# Altium schematic sheet PULSECAPS.SchDoc
size B
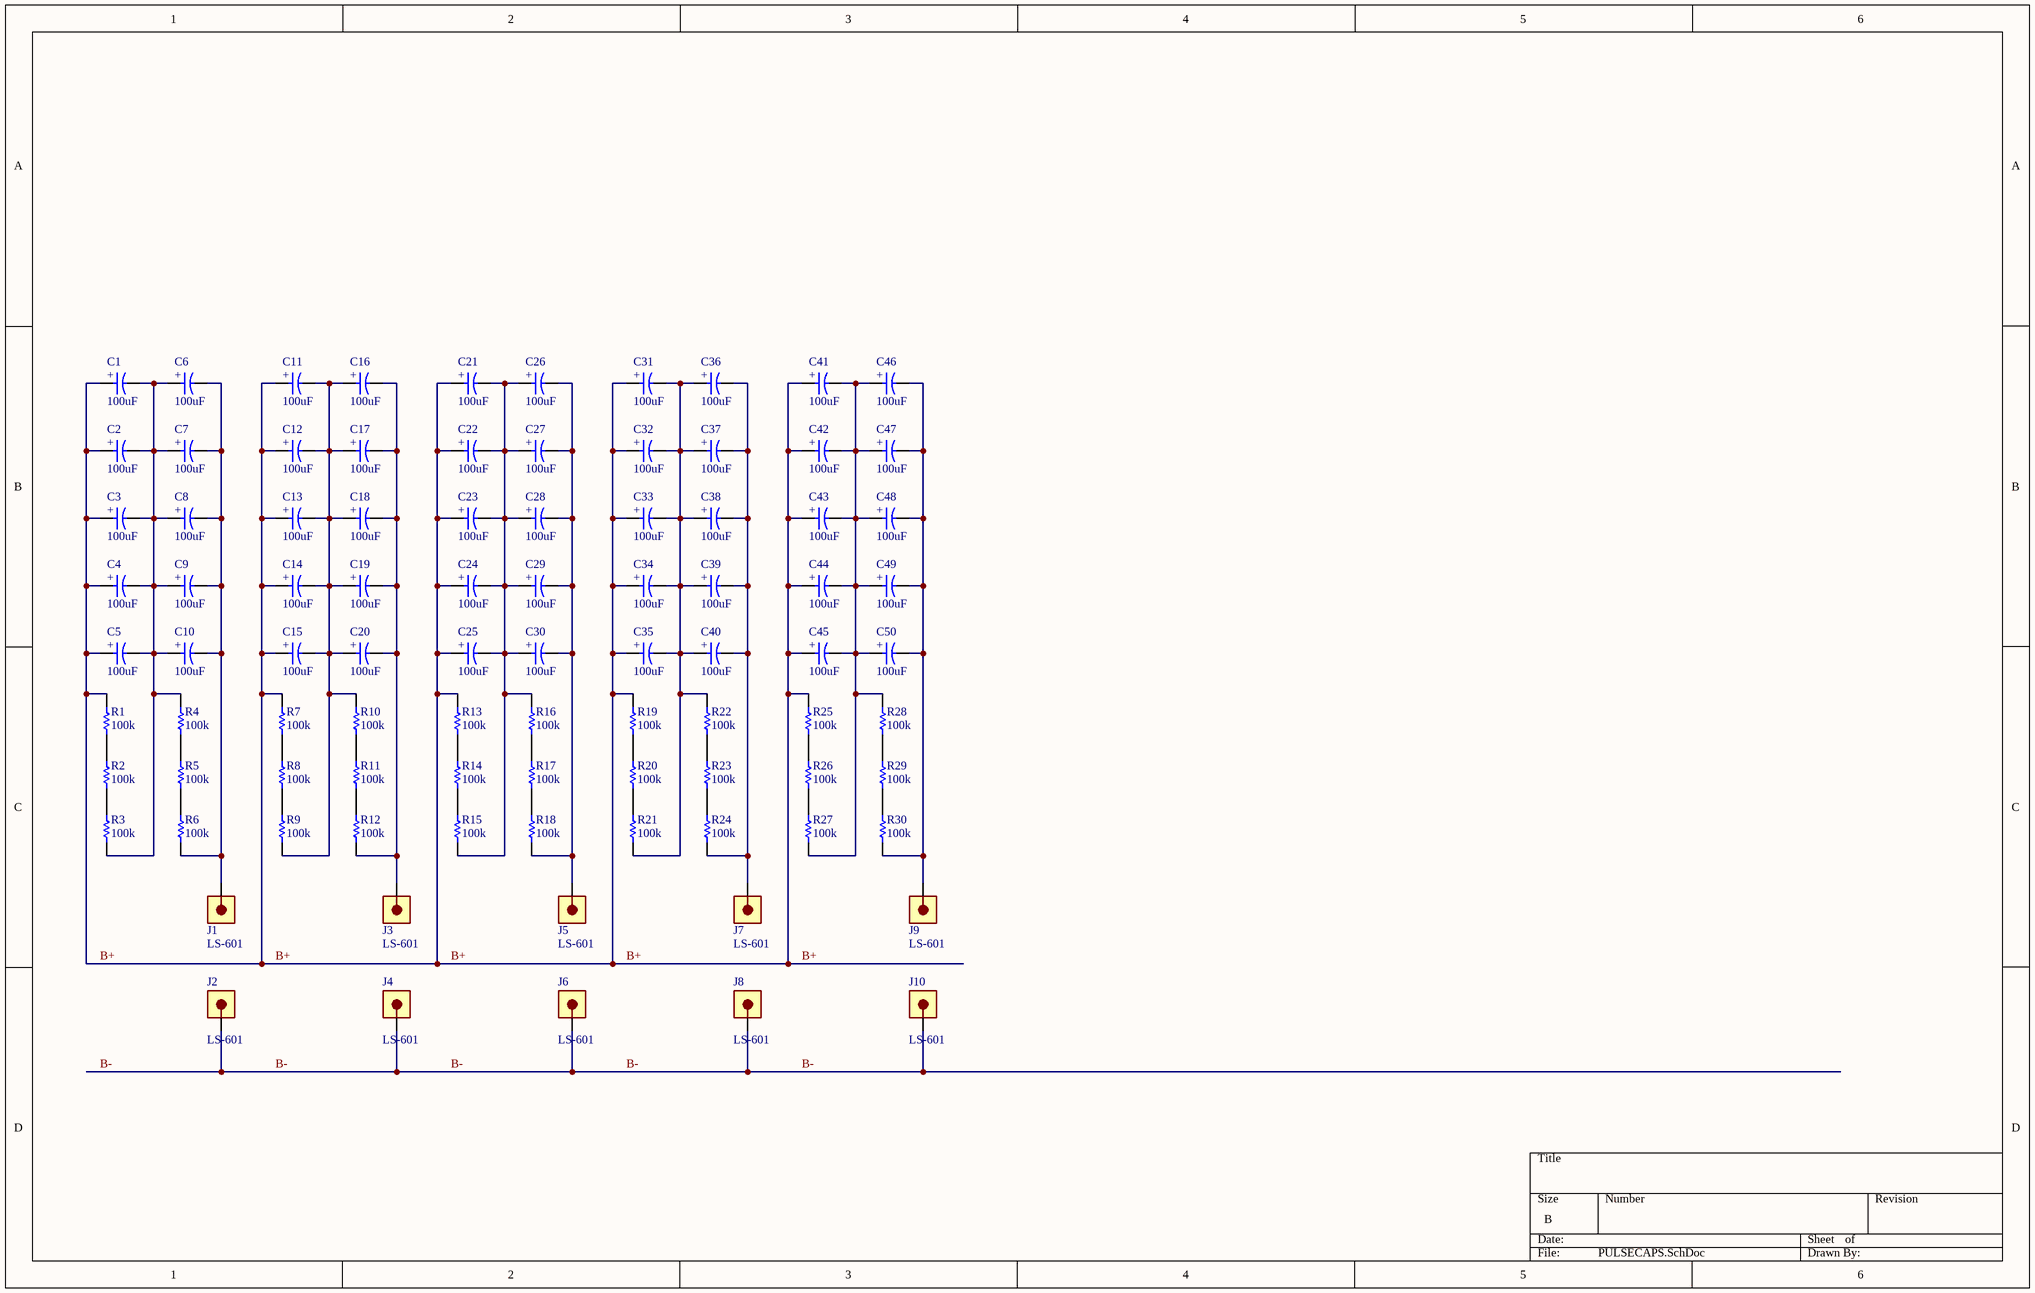
[diagram p0: PULSECAPS.SchDoc]

## Parts
C1  value 100uF  [C_CAN_TH_7.5MM_LEADS]  (hidden comment: 400BXW100MEFR16X30)
C2  value 100uF  [C_CAN_TH_7.5MM_LEADS]  (hidden comment: 400BXW100MEFR16X30)
C3  value 100uF  [C_CAN_TH_7.5MM_LEADS]  (hidden comment: 400BXW100MEFR16X30)
C4  value 100uF  [C_CAN_TH_7.5MM_LEADS]  (hidden comment: 400BXW100MEFR16X30)
C5  value 100uF  [C_CAN_TH_7.5MM_LEADS]  (hidden comment: 400BXW100MEFR16X30)
C6  value 100uF  [C_CAN_TH_7.5MM_LEADS]  (hidden comment: 400BXW100MEFR16X30)
C7  value 100uF  [C_CAN_TH_7.5MM_LEADS]  (hidden comment: 400BXW100MEFR16X30)
C8  value 100uF  [C_CAN_TH_7.5MM_LEADS]  (hidden comment: 400BXW100MEFR16X30)
C9  value 100uF  [C_CAN_TH_7.5MM_LEADS]  (hidden comment: 400BXW100MEFR16X30)
C10  value 100uF  [C_CAN_TH_7.5MM_LEADS]  (hidden comment: 400BXW100MEFR16X30)
C11  value 100uF  [C_CAN_TH_7.5MM_LEADS]  (hidden comment: 400BXW100MEFR16X30)
C12  value 100uF  [C_CAN_TH_7.5MM_LEADS]  (hidden comment: 400BXW100MEFR16X30)
C13  value 100uF  [C_CAN_TH_7.5MM_LEADS]  (hidden comment: 400BXW100MEFR16X30)
C14  value 100uF  [C_CAN_TH_7.5MM_LEADS]  (hidden comment: 400BXW100MEFR16X30)
C15  value 100uF  [C_CAN_TH_7.5MM_LEADS]  (hidden comment: 400BXW100MEFR16X30)
C16  value 100uF  [C_CAN_TH_7.5MM_LEADS]  (hidden comment: 400BXW100MEFR16X30)
C17  value 100uF  [C_CAN_TH_7.5MM_LEADS]  (hidden comment: 400BXW100MEFR16X30)
C18  value 100uF  [C_CAN_TH_7.5MM_LEADS]  (hidden comment: 400BXW100MEFR16X30)
C19  value 100uF  [C_CAN_TH_7.5MM_LEADS]  (hidden comment: 400BXW100MEFR16X30)
C20  value 100uF  [C_CAN_TH_7.5MM_LEADS]  (hidden comment: 400BXW100MEFR16X30)
C21  value 100uF  [C_CAN_TH_7.5MM_LEADS]  (hidden comment: 400BXW100MEFR16X30)
C22  value 100uF  [C_CAN_TH_7.5MM_LEADS]  (hidden comment: 400BXW100MEFR16X30)
C23  value 100uF  [C_CAN_TH_7.5MM_LEADS]  (hidden comment: 400BXW100MEFR16X30)
C24  value 100uF  [C_CAN_TH_7.5MM_LEADS]  (hidden comment: 400BXW100MEFR16X30)
C25  value 100uF  [C_CAN_TH_7.5MM_LEADS]  (hidden comment: 400BXW100MEFR16X30)
C26  value 100uF  [C_CAN_TH_7.5MM_LEADS]  (hidden comment: 400BXW100MEFR16X30)
C27  value 100uF  [C_CAN_TH_7.5MM_LEADS]  (hidden comment: 400BXW100MEFR16X30)
C28  value 100uF  [C_CAN_TH_7.5MM_LEADS]  (hidden comment: 400BXW100MEFR16X30)
C29  value 100uF  [C_CAN_TH_7.5MM_LEADS]  (hidden comment: 400BXW100MEFR16X30)
C30  value 100uF  [C_CAN_TH_7.5MM_LEADS]  (hidden comment: 400BXW100MEFR16X30)
C31  value 100uF  [C_CAN_TH_7.5MM_LEADS]  (hidden comment: 400BXW100MEFR16X30)
C32  value 100uF  [C_CAN_TH_7.5MM_LEADS]  (hidden comment: 400BXW100MEFR16X30)
C33  value 100uF  [C_CAN_TH_7.5MM_LEADS]  (hidden comment: 400BXW100MEFR16X30)
C34  value 100uF  [C_CAN_TH_7.5MM_LEADS]  (hidden comment: 400BXW100MEFR16X30)
C35  value 100uF  [C_CAN_TH_7.5MM_LEADS]  (hidden comment: 400BXW100MEFR16X30)
C36  value 100uF  [C_CAN_TH_7.5MM_LEADS]  (hidden comment: 400BXW100MEFR16X30)
C37  value 100uF  [C_CAN_TH_7.5MM_LEADS]  (hidden comment: 400BXW100MEFR16X30)
C38  value 100uF  [C_CAN_TH_7.5MM_LEADS]  (hidden comment: 400BXW100MEFR16X30)
C39  value 100uF  [C_CAN_TH_7.5MM_LEADS]  (hidden comment: 400BXW100MEFR16X30)
C40  value 100uF  [C_CAN_TH_7.5MM_LEADS]  (hidden comment: 400BXW100MEFR16X30)
C41  value 100uF  [C_CAN_TH_7.5MM_LEADS]  (hidden comment: 400BXW100MEFR16X30)
C42  value 100uF  [C_CAN_TH_7.5MM_LEADS]  (hidden comment: 400BXW100MEFR16X30)
C43  value 100uF  [C_CAN_TH_7.5MM_LEADS]  (hidden comment: 400BXW100MEFR16X30)
C44  value 100uF  [C_CAN_TH_7.5MM_LEADS]  (hidden comment: 400BXW100MEFR16X30)
C45  value 100uF  [C_CAN_TH_7.5MM_LEADS]  (hidden comment: 400BXW100MEFR16X30)
C46  value 100uF  [C_CAN_TH_7.5MM_LEADS]  (hidden comment: 400BXW100MEFR16X30)
C47  value 100uF  [C_CAN_TH_7.5MM_LEADS]  (hidden comment: 400BXW100MEFR16X30)
C48  value 100uF  [C_CAN_TH_7.5MM_LEADS]  (hidden comment: 400BXW100MEFR16X30)
C49  value 100uF  [C_CAN_TH_7.5MM_LEADS]  (hidden comment: 400BXW100MEFR16X30)
C50  value 100uF  [C_CAN_TH_7.5MM_LEADS]  (hidden comment: 400BXW100MEFR16X30)
J1  LS-601  [LS-601]
J2  LS-601  [LS-601]
J3  LS-601  [LS-601]
J4  LS-601  [LS-601]
J5  LS-601  [LS-601]
J6  LS-601  [LS-601]
J7  LS-601  [LS-601]
J8  LS-601  [LS-601]
J9  LS-601  [LS-601]
J10  LS-601  [LS-601]
R1  value 100k  [R_1206]  (hidden comment: 1206W4F1003T5E)
R2  value 100k  [R_1206]  (hidden comment: 1206W4F1003T5E)
R3  value 100k  [R_1206]  (hidden comment: 1206W4F1003T5E)
R4  value 100k  [R_1206]  (hidden comment: 1206W4F1003T5E)
R5  value 100k  [R_1206]  (hidden comment: 1206W4F1003T5E)
R6  value 100k  [R_1206]  (hidden comment: 1206W4F1003T5E)
R7  value 100k  [R_1206]  (hidden comment: 1206W4F1003T5E)
R8  value 100k  [R_1206]  (hidden comment: 1206W4F1003T5E)
R9  value 100k  [R_1206]  (hidden comment: 1206W4F1003T5E)
R10  value 100k  [R_1206]  (hidden comment: 1206W4F1003T5E)
R11  value 100k  [R_1206]  (hidden comment: 1206W4F1003T5E)
R12  value 100k  [R_1206]  (hidden comment: 1206W4F1003T5E)
R13  value 100k  [R_1206]  (hidden comment: 1206W4F1003T5E)
R14  value 100k  [R_1206]  (hidden comment: 1206W4F1003T5E)
R15  value 100k  [R_1206]  (hidden comment: 1206W4F1003T5E)
R16  value 100k  [R_1206]  (hidden comment: 1206W4F1003T5E)
R17  value 100k  [R_1206]  (hidden comment: 1206W4F1003T5E)
R18  value 100k  [R_1206]  (hidden comment: 1206W4F1003T5E)
R19  value 100k  [R_1206]  (hidden comment: 1206W4F1003T5E)
R20  value 100k  [R_1206]  (hidden comment: 1206W4F1003T5E)
R21  value 100k  [R_1206]  (hidden comment: 1206W4F1003T5E)
R22  value 100k  [R_1206]  (hidden comment: 1206W4F1003T5E)
R23  value 100k  [R_1206]  (hidden comment: 1206W4F1003T5E)
R24  value 100k  [R_1206]  (hidden comment: 1206W4F1003T5E)
R25  value 100k  [R_1206]  (hidden comment: 1206W4F1003T5E)
R26  value 100k  [R_1206]  (hidden comment: 1206W4F1003T5E)
R27  value 100k  [R_1206]  (hidden comment: 1206W4F1003T5E)
R28  value 100k  [R_1206]  (hidden comment: 1206W4F1003T5E)
R29  value 100k  [R_1206]  (hidden comment: 1206W4F1003T5E)
R30  value 100k  [R_1206]  (hidden comment: 1206W4F1003T5E)

## Nets
B+: C1.2 C2.2 C3.2 C4.2 C5.2 C11.2 C12.2 C13.2 C14.2 C15.2 C21.2 C22.2 C23.2 C24.2 C25.2 C31.2 C32.2 C33.2 C34.2 C35.2 C41.2 C42.2 C43.2 C44.2 C45.2 R1.2 R7.2 R13.2 R19.2 R25.2
B-: J2.1 J4.1 J6.1 J8.1 J10.1
NetC1_1: C1.1 C2.1 C3.1 C4.1 C5.1 C6.2 C7.2 C8.2 C9.2 C10.2 R3.1 R4.2
NetC6_1: C6.1 C7.1 C8.1 C9.1 C10.1 J1.1 R6.1
NetC11_1: C11.1 C12.1 C13.1 C14.1 C15.1 C16.2 C17.2 C18.2 C19.2 C20.2 R9.1 R10.2
NetC16_1: C16.1 C17.1 C18.1 C19.1 C20.1 J3.1 R12.1
NetC21_1: C21.1 C22.1 C23.1 C24.1 C25.1 C26.2 C27.2 C28.2 C29.2 C30.2 R15.1 R16.2
NetC26_1: C26.1 C27.1 C28.1 C29.1 C30.1 J5.1 R18.1
NetC31_1: C31.1 C32.1 C33.1 C34.1 C35.1 C36.2 C37.2 C38.2 C39.2 C40.2 R21.1 R22.2
NetC36_1: C36.1 C37.1 C38.1 C39.1 C40.1 J7.1 R24.1
NetC41_1: C41.1 C42.1 C43.1 C44.1 C45.1 C46.2 C47.2 C48.2 C49.2 C50.2 R27.1 R28.2
NetC46_1: C46.1 C47.1 C48.1 C49.1 C50.1 J9.1 R30.1
NetR1_1: R1.1 R2.2
NetR2_1: R2.1 R3.2
NetR4_1: R4.1 R5.2
NetR5_1: R5.1 R6.2
NetR7_1: R7.1 R8.2
NetR8_1: R8.1 R9.2
NetR10_1: R10.1 R11.2
NetR11_1: R11.1 R12.2
NetR13_1: R13.1 R14.2
NetR14_1: R14.1 R15.2
NetR16_1: R16.1 R17.2
NetR17_1: R17.1 R18.2
NetR19_1: R19.1 R20.2
NetR20_1: R20.1 R21.2
NetR22_1: R22.1 R23.2
NetR23_1: R23.1 R24.2
NetR25_1: R25.1 R26.2
NetR26_1: R26.1 R27.2
NetR28_1: R28.1 R29.2
NetR29_1: R29.1 R30.2

## Notes on the sheet
- (in symbol 400BXW100MEFR16X30) +

## Library data of the parts
C1-C50 = 400BXW100MEFR16X30: C - CAPACITOR - ELECTROLYTIC - 100uF - 400V; WVDC: 400; ESR: 40mOhm; JLC Availability: Extended; LCSC Part #: C441621
J1-J10 = LS-601: J - JACK - FUSEHOLDER - 6X30 - THT; LCSC Part #: C182321; JLC Availability: Extended
R1-R30 = 1206W4F1003T5E: R - RESISTOR - SMD - 100k - 1% - 1206; LCSC Part #: C17900; JLC Availability: Basic